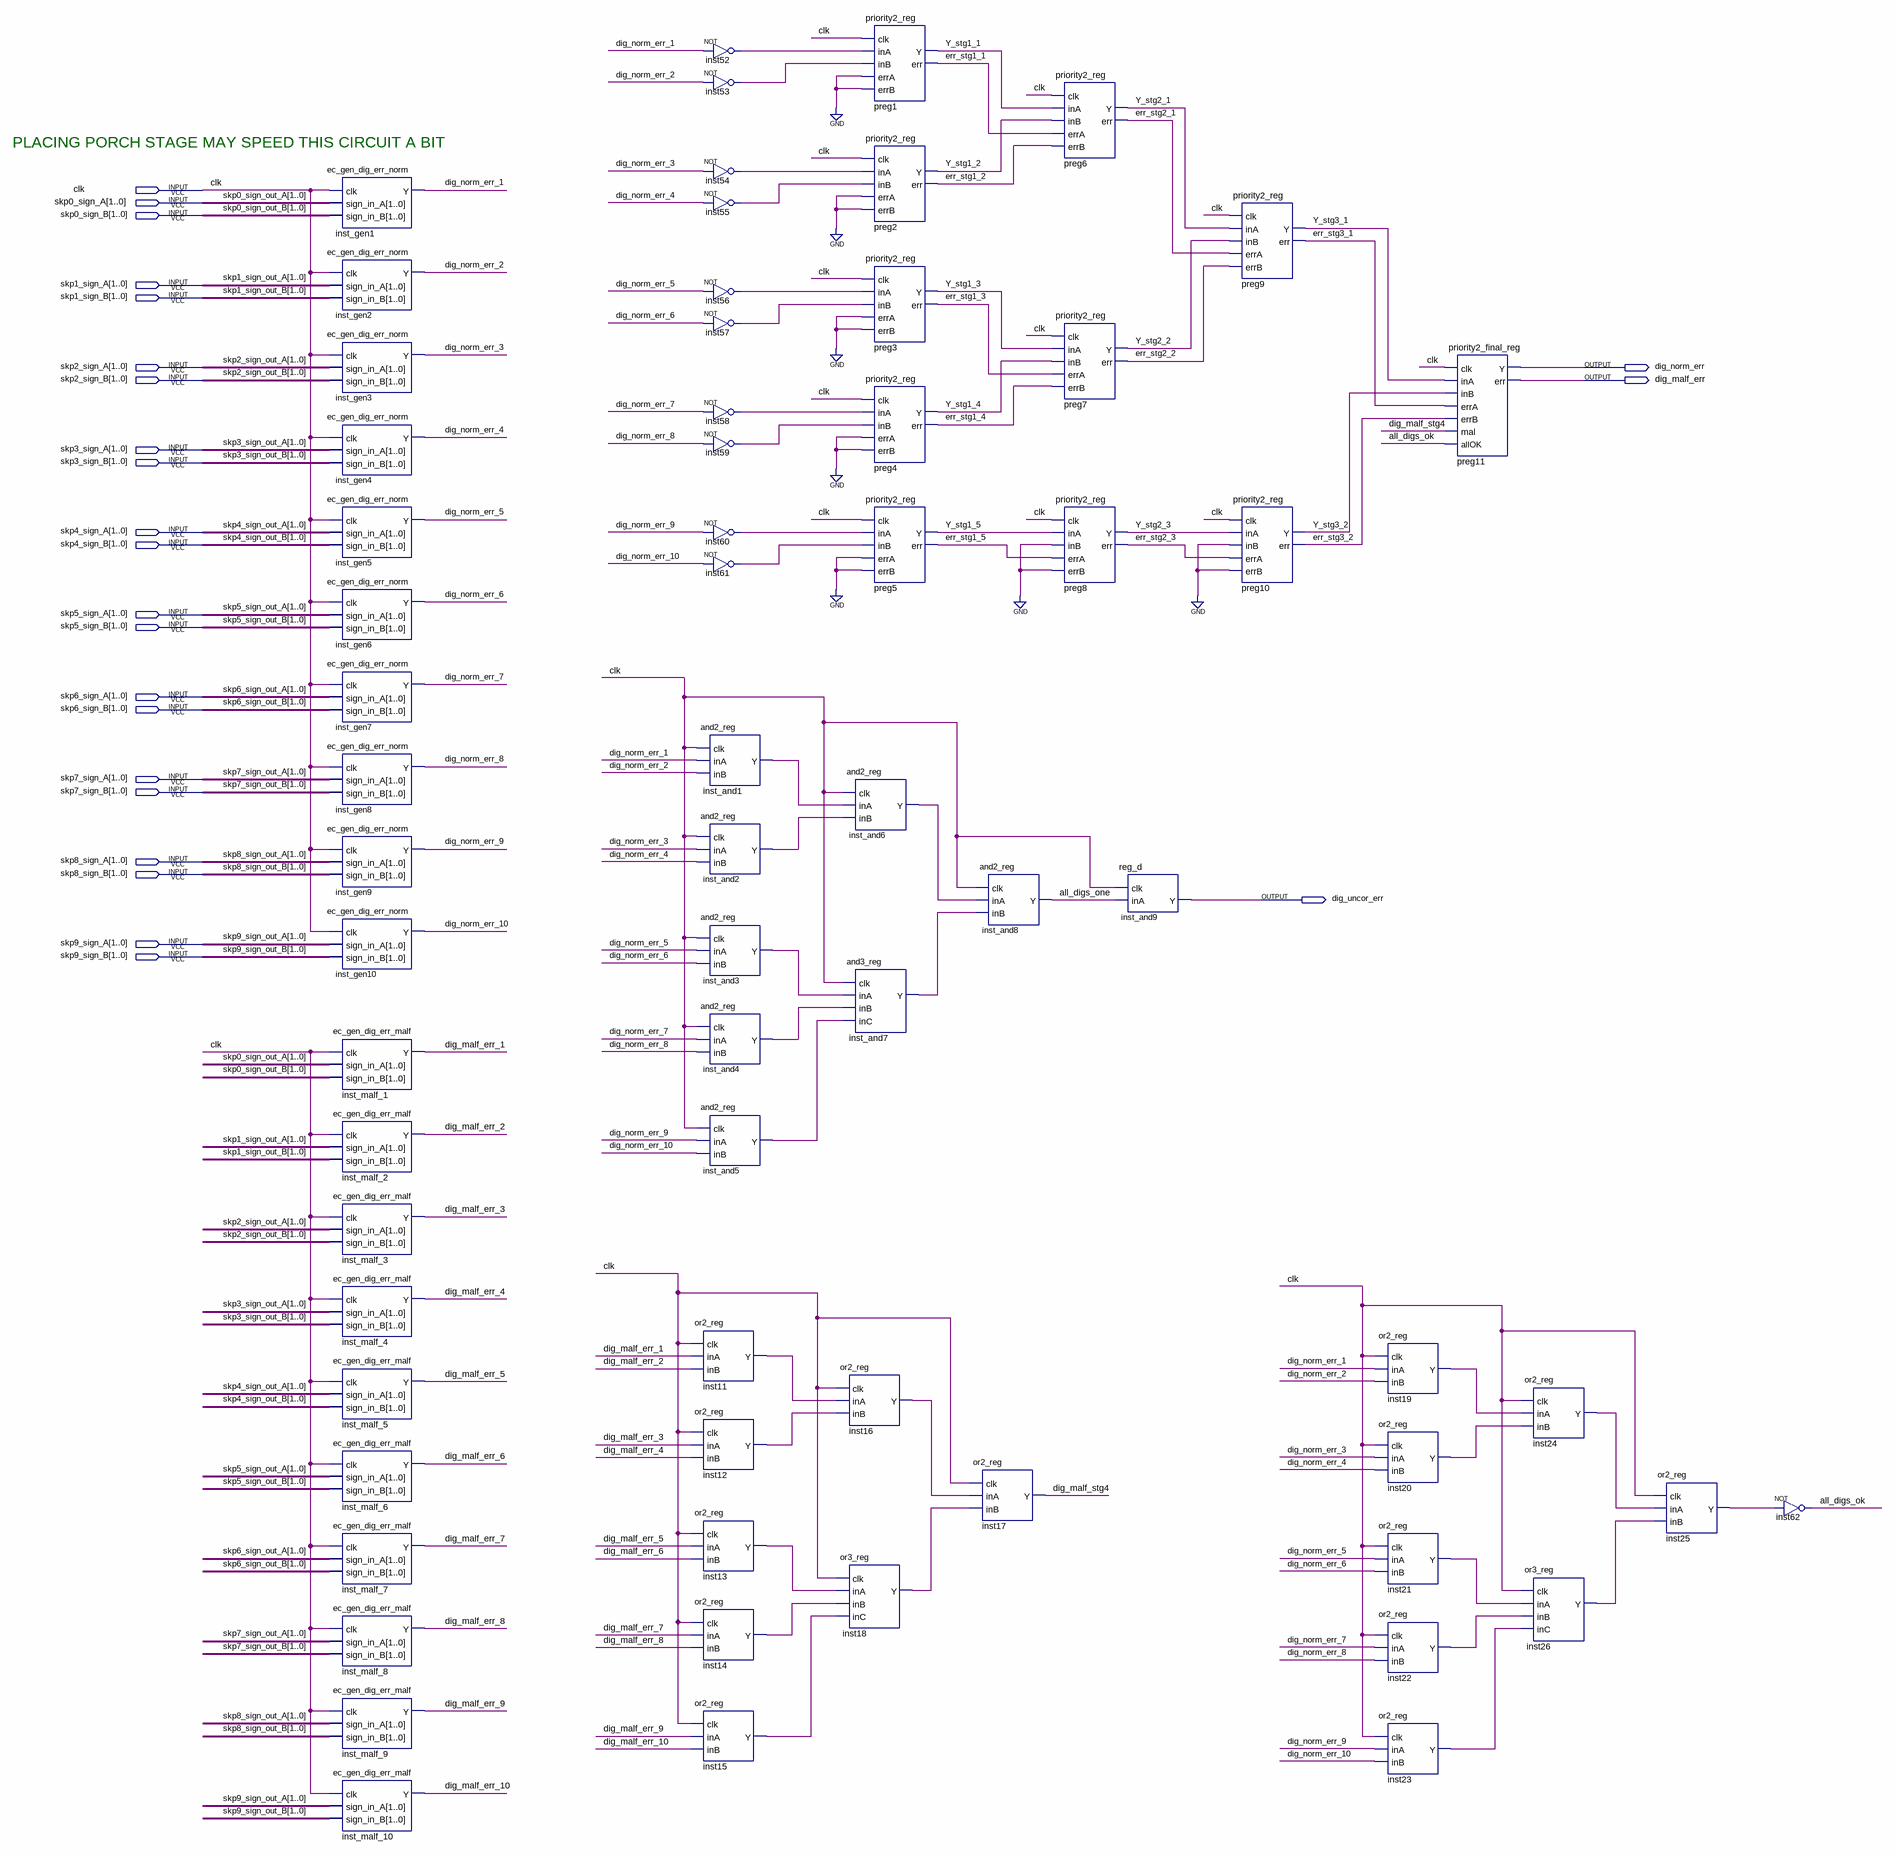
[diagram p0: schematic sheet]
// Quartus schematic ec_gen_error_5L.bdf as structural Verilog: 67 symbols, 24 pins
module ec_gen_error_5L (
  input  clk,
  input  [1:0] skp0_sign_A,
  input  [1:0] skp0_sign_B,
  input  [1:0] skp1_sign_A,
  input  [1:0] skp1_sign_B,
  input  [1:0] skp2_sign_A,
  input  [1:0] skp2_sign_B,
  input  [1:0] skp3_sign_A,
  input  [1:0] skp3_sign_B,
  input  [1:0] skp4_sign_A,
  input  [1:0] skp4_sign_B,
  input  [1:0] skp5_sign_A,
  input  [1:0] skp5_sign_B,
  input  [1:0] skp6_sign_A,
  input  [1:0] skp6_sign_B,
  input  [1:0] skp7_sign_A,
  input  [1:0] skp7_sign_B,
  input  [1:0] skp8_sign_A,
  input  [1:0] skp8_sign_B,
  input  [1:0] skp9_sign_A,
  input  [1:0] skp9_sign_B,
  output dig_norm_err,
  output dig_malf_err,
  output dig_uncor_err
);

  wire all_digs_ok, all_digs_one, dig_malf_err_1, dig_malf_err_2, dig_malf_err_3, dig_malf_err_4,
       dig_malf_err_5, dig_malf_err_6, dig_malf_err_7, dig_malf_err_8, dig_malf_err_9, dig_malf_err_10,
       dig_malf_stg4, dig_norm_err_1, dig_norm_err_2, dig_norm_err_3, dig_norm_err_4, dig_norm_err_5,
       dig_norm_err_6, dig_norm_err_7, dig_norm_err_8, dig_norm_err_9, dig_norm_err_10, err_stg1_1,
       err_stg1_2, err_stg1_3, err_stg1_4, err_stg1_5, err_stg2_1, err_stg2_2, err_stg2_3, err_stg3_1,
       err_stg3_2, inst11_y, inst12_y, inst13_y, inst14_y, inst15_y, inst16_y, inst18_y, inst19_y, inst20_y,
       inst21_y, inst22_y, inst23_y, inst24_y, inst25_y, inst26_y, inst52_out, inst53_out, inst54_out,
       inst55_out, inst56_out, inst57_out, inst58_out, inst59_out, inst60_out, inst61_out, inst_and1_y,
       inst_and2_y, inst_and3_y, inst_and4_y, inst_and5_y, inst_and6_y, inst_and7_y, Y_stg1_1, Y_stg1_2,
       Y_stg1_3, Y_stg1_4, Y_stg1_5, Y_stg2_1, Y_stg2_2, Y_stg2_3, Y_stg3_1, Y_stg3_2;

  ec_gen_dig_err_norm inst_gen1 (.clk(clk), .sign_in_A(skp0_sign_A), .sign_in_B(skp0_sign_B), .Y(dig_norm_err_1));
  ec_gen_dig_err_norm inst_gen2 (.clk(clk), .sign_in_A(skp1_sign_A), .sign_in_B(skp1_sign_B), .Y(dig_norm_err_2));
  ec_gen_dig_err_norm inst_gen3 (.clk(clk), .sign_in_A(skp2_sign_A), .sign_in_B(skp2_sign_B), .Y(dig_norm_err_3));
  ec_gen_dig_err_norm inst_gen4 (.clk(clk), .sign_in_A(skp3_sign_A), .sign_in_B(skp3_sign_B), .Y(dig_norm_err_4));
  ec_gen_dig_err_norm inst_gen5 (.clk(clk), .sign_in_A(skp4_sign_A), .sign_in_B(skp4_sign_B), .Y(dig_norm_err_5));
  ec_gen_dig_err_norm inst_gen6 (.clk(clk), .sign_in_A(skp5_sign_A), .sign_in_B(skp5_sign_B), .Y(dig_norm_err_6));
  ec_gen_dig_err_norm inst_gen7 (.clk(clk), .sign_in_A(skp6_sign_A), .sign_in_B(skp6_sign_B), .Y(dig_norm_err_7));
  ec_gen_dig_err_norm inst_gen8 (.clk(clk), .sign_in_A(skp7_sign_A), .sign_in_B(skp7_sign_B), .Y(dig_norm_err_8));
  ec_gen_dig_err_norm inst_gen9 (.clk(clk), .sign_in_A(skp8_sign_A), .sign_in_B(skp8_sign_B), .Y(dig_norm_err_9));
  ec_gen_dig_err_norm inst_gen10 (.clk(clk), .sign_in_A(skp9_sign_A), .sign_in_B(skp9_sign_B), .Y(dig_norm_err_10));
  ec_gen_dig_err_malf inst_malf_1 (.clk(clk), .sign_in_A(skp0_sign_A), .sign_in_B(skp0_sign_B), .Y(dig_malf_err_1));
  ec_gen_dig_err_malf inst_malf_2 (.clk(clk), .sign_in_A(skp1_sign_A), .sign_in_B(skp1_sign_B), .Y(dig_malf_err_2));
  ec_gen_dig_err_malf inst_malf_3 (.clk(clk), .sign_in_A(skp2_sign_A), .sign_in_B(skp2_sign_B), .Y(dig_malf_err_3));
  ec_gen_dig_err_malf inst_malf_4 (.clk(clk), .sign_in_A(skp3_sign_A), .sign_in_B(skp3_sign_B), .Y(dig_malf_err_4));
  ec_gen_dig_err_malf inst_malf_5 (.clk(clk), .sign_in_A(skp4_sign_A), .sign_in_B(skp4_sign_B), .Y(dig_malf_err_5));
  ec_gen_dig_err_malf inst_malf_6 (.clk(clk), .sign_in_A(skp5_sign_A), .sign_in_B(skp5_sign_B), .Y(dig_malf_err_6));
  ec_gen_dig_err_malf inst_malf_7 (.clk(clk), .sign_in_A(skp6_sign_A), .sign_in_B(skp6_sign_B), .Y(dig_malf_err_7));
  ec_gen_dig_err_malf inst_malf_8 (.clk(clk), .sign_in_A(skp7_sign_A), .sign_in_B(skp7_sign_B), .Y(dig_malf_err_8));
  ec_gen_dig_err_malf inst_malf_9 (.clk(clk), .sign_in_A(skp8_sign_A), .sign_in_B(skp8_sign_B), .Y(dig_malf_err_9));
  ec_gen_dig_err_malf inst_malf_10 (.clk(clk), .sign_in_A(skp9_sign_A), .sign_in_B(skp9_sign_B), .Y(dig_malf_err_10));
  not inst52 (inst52_out, dig_norm_err_1);
  not inst53 (inst53_out, dig_norm_err_2);
  not inst54 (inst54_out, dig_norm_err_3);
  not inst55 (inst55_out, dig_norm_err_4);
  not inst56 (inst56_out, dig_norm_err_5);
  not inst57 (inst57_out, dig_norm_err_6);
  not inst58 (inst58_out, dig_norm_err_7);
  not inst59 (inst59_out, dig_norm_err_8);
  not inst60 (inst60_out, dig_norm_err_9);
  not inst61 (inst61_out, dig_norm_err_10);
  and2_reg inst_and1 (.clk(clk), .inA(dig_norm_err_1), .inB(dig_norm_err_2), .Y(inst_and1_y));
  and2_reg inst_and2 (.clk(clk), .inA(dig_norm_err_3), .inB(dig_norm_err_4), .Y(inst_and2_y));
  and2_reg inst_and3 (.clk(clk), .inA(dig_norm_err_5), .inB(dig_norm_err_6), .Y(inst_and3_y));
  and2_reg inst_and4 (.clk(clk), .inA(dig_norm_err_7), .inB(dig_norm_err_8), .Y(inst_and4_y));
  and2_reg inst_and5 (.clk(clk), .inA(dig_norm_err_9), .inB(dig_norm_err_10), .Y(inst_and5_y));
  or2_reg inst11 (.clk(clk), .inA(dig_malf_err_1), .inB(dig_malf_err_2), .Y(inst11_y));
  or2_reg inst12 (.clk(clk), .inA(dig_malf_err_3), .inB(dig_malf_err_4), .Y(inst12_y));
  or2_reg inst13 (.clk(clk), .inA(dig_malf_err_5), .inB(dig_malf_err_6), .Y(inst13_y));
  or2_reg inst14 (.clk(clk), .inA(dig_malf_err_7), .inB(dig_malf_err_8), .Y(inst14_y));
  or2_reg inst15 (.clk(clk), .inA(dig_malf_err_9), .inB(dig_malf_err_10), .Y(inst15_y));
  or2_reg inst16 (.clk(clk), .inA(inst11_y), .inB(inst12_y), .Y(inst16_y));
  or3_reg inst18 (.clk(clk), .inA(inst13_y), .inB(inst14_y), .inC(inst15_y), .Y(inst18_y));
  priority2_reg preg1 (
    .clk(clk), .inA(inst52_out), .inB(inst53_out), .errA(1'b0), .errB(1'b0), .Y(Y_stg1_1), .err(err_stg1_1));
  priority2_reg preg2 (
    .clk(clk), .inA(inst54_out), .inB(inst55_out), .errA(1'b0), .errB(1'b0), .Y(Y_stg1_2), .err(err_stg1_2));
  priority2_reg preg3 (
    .clk(clk), .inA(inst56_out), .inB(inst57_out), .errA(1'b0), .errB(1'b0), .Y(Y_stg1_3), .err(err_stg1_3));
  priority2_reg preg4 (
    .clk(clk), .inA(inst58_out), .inB(inst59_out), .errA(1'b0), .errB(1'b0), .Y(Y_stg1_4), .err(err_stg1_4));
  priority2_reg preg5 (
    .clk(clk), .inA(inst60_out), .inB(inst61_out), .errA(1'b0), .errB(1'b0), .Y(Y_stg1_5), .err(err_stg1_5));
  and2_reg inst_and6 (.clk(clk), .inA(inst_and1_y), .inB(inst_and2_y), .Y(inst_and6_y));
  and3_reg inst_and7 (.clk(clk), .inA(inst_and3_y), .inB(inst_and4_y), .inC(inst_and5_y), .Y(inst_and7_y));
  and2_reg inst_and8 (.clk(clk), .inA(inst_and6_y), .inB(inst_and7_y), .Y(all_digs_one));
  or2_reg inst17 (.clk(clk), .inA(inst16_y), .inB(inst18_y), .Y(dig_malf_stg4));
  priority2_reg preg6 (
    .clk(clk), .inA(Y_stg1_1), .inB(Y_stg1_2), .errA(err_stg1_1), .errB(err_stg1_2), .Y(Y_stg2_1),
    .err(err_stg2_1));
  priority2_reg preg7 (
    .clk(clk), .inA(Y_stg1_3), .inB(Y_stg1_4), .errA(err_stg1_3), .errB(err_stg1_4), .Y(Y_stg2_2),
    .err(err_stg2_2));
  priority2_reg preg8 (
    .clk(clk), .inA(Y_stg1_5), .inB(1'b0), .errA(err_stg1_5), .errB(1'b0), .Y(Y_stg2_3), .err(err_stg2_3));
  reg_d inst_and9 (.clk(clk), .inA(all_digs_one), .Y(dig_uncor_err));
  priority2_reg preg9 (
    .clk(clk), .inA(Y_stg2_1), .inB(Y_stg2_2), .errA(err_stg2_1), .errB(err_stg2_2), .Y(Y_stg3_1),
    .err(err_stg3_1));
  priority2_reg preg10 (
    .clk(clk), .inA(Y_stg2_3), .inB(1'b0), .errA(err_stg2_3), .errB(1'b0), .Y(Y_stg3_2), .err(err_stg3_2));
  or2_reg inst19 (.clk(clk), .inA(dig_norm_err_1), .inB(dig_norm_err_2), .Y(inst19_y));
  or2_reg inst20 (.clk(clk), .inA(dig_norm_err_3), .inB(dig_norm_err_4), .Y(inst20_y));
  or2_reg inst21 (.clk(clk), .inA(dig_norm_err_5), .inB(dig_norm_err_6), .Y(inst21_y));
  or2_reg inst22 (.clk(clk), .inA(dig_norm_err_7), .inB(dig_norm_err_8), .Y(inst22_y));
  or2_reg inst23 (.clk(clk), .inA(dig_norm_err_9), .inB(dig_norm_err_10), .Y(inst23_y));
  priority2_final_reg preg11 (
    .clk(clk), .inA(Y_stg3_1), .inB(Y_stg3_2), .errA(err_stg3_1), .errB(err_stg3_2), .mal(dig_malf_stg4),
    .allOK(all_digs_ok), .Y(dig_norm_err), .err(dig_malf_err));
  or2_reg inst24 (.clk(clk), .inA(inst19_y), .inB(inst20_y), .Y(inst24_y));
  or3_reg inst26 (.clk(clk), .inA(inst21_y), .inB(inst22_y), .inC(inst23_y), .Y(inst26_y));
  or2_reg inst25 (.clk(clk), .inA(inst24_y), .inB(inst26_y), .Y(inst25_y));
  not inst62 (all_digs_ok, inst25_y);

  // Other names for the same wires on the sheet: skp0_sign_out_A[1:0] = skp0_sign_A;
  //   skp0_sign_out_B[1:0] = skp0_sign_B; skp1_sign_out_A[1:0] = skp1_sign_A; skp1_sign_out_B[1:0] = skp1_sign_B;
  //   skp2_sign_out_A[1:0] = skp2_sign_A; skp2_sign_out_B[1:0] = skp2_sign_B; skp3_sign_out_A[1:0] = skp3_sign_A;
  //   skp3_sign_out_B[1:0] = skp3_sign_B; skp4_sign_out_A[1:0] = skp4_sign_A; skp4_sign_out_B[1:0] = skp4_sign_B;
  //   skp5_sign_out_A[1:0] = skp5_sign_A; skp5_sign_out_B[1:0] = skp5_sign_B; skp6_sign_out_A[1:0] = skp6_sign_A;
  //   skp6_sign_out_B[1:0] = skp6_sign_B; skp7_sign_out_A[1:0] = skp7_sign_A; skp7_sign_out_B[1:0] = skp7_sign_B;
  //   skp8_sign_out_A[1:0] = skp8_sign_A; skp8_sign_out_B[1:0] = skp8_sign_B; skp9_sign_out_A[1:0] = skp9_sign_A;
  //   skp9_sign_out_B[1:0] = skp9_sign_B

  // Notes on the sheet:
  //   PLACING PORCH STAGE MAY SPEED THIS CIRCUIT A BIT
endmodule
